# Altium schematic sheet RCD Snubber circuit.SchDoc
size B; Organization: Altium Limited; Address1: L3, 12a Rodborough Rd; Address2: Frenchs Forest; Address3: NSW; Address4: Australia 2086; SheetNumber: 1; SheetTotal: 1
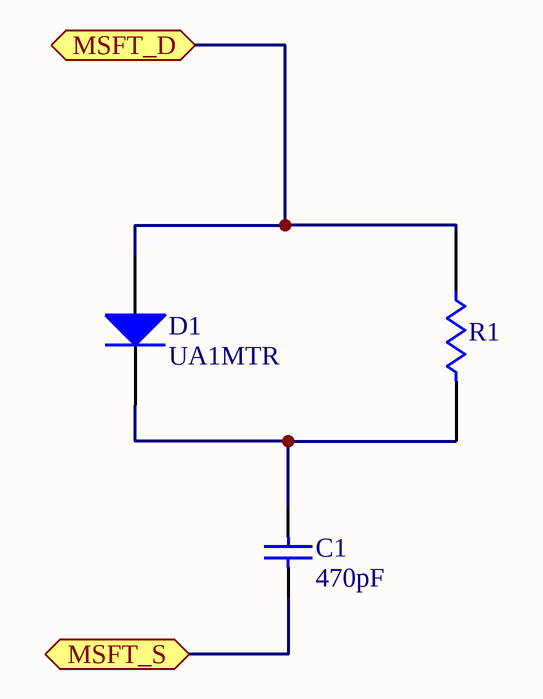
[diagram p0: RCD Snubber circuit.SchDoc]

## Parts
C1  Capacitance: 470pF  [CAP2220]  (hidden comment: C2220_Generic)
D1  UA1MTR  [DO-214AC]
R1  R2512_Generic  [RES2512]  (value not drawn)

## Ports
MSFT_D, MSFT_S

## Nets
MSFT_D: D1.2(A) R1.1 ; port MSFT_D
MSFT_S: C1.1 ; port MSFT_S
NetC1_2: C1.2 D1.1(K) R1.2

## Notes on the sheet
- Title:
- Size:
- B
- Document Number:
- Revision:
- Designer:
- Approval Date:
- Start Date:
- MM/DD/YY
- --/--/--
- Sheet:
- of
- Approver:
- CONFIDENTIAL
- Project Name/Number:

## Library data of the parts
D1 = UA1MTR: DIODE SCHOTTKY 1KV 1A SMA; Manufacturer: SMC Diode Solutions; Voltage - Forward (Vf) (Max) @ If: 1.7V @ 1A; Speed: Fast Recovery =< 500ns, > 200mA (Io); Current - Reverse Leakage @ Vr: 3µA @ 1000V; Supplier 1: Digi-Key; RoHS: RoHS Compliant; Category: Discrete Semiconductor Products; Stock 1: 48770; Pricing 1: 1=0.5, 10=0.358, 25=0.2784, 100=0.2109, 250=0.14924, 500=0.11938, 1000=0.09153, 2500=0.07959 (USD); Packaging: Cut Tape (CT); Part Status: Active; Diode Type: Schottky; Current - Average Rectified (Io): 1A; Capacitance @ Vr, F: -; Mounting Type: Surface Mount; Package / Case: DO-214AC, SMA; Supplier Device Package: SMA (DO-214AC); Operating Temperature - Junction: -55°C ~ 150°C; ComponentLink1URL: http://www.smc-diodes.com/propdf/UA1(A-M)%20N1509%20REV.-.pdf; ComponentLink1Description: http://www.smc-diodes.com/propdf/UA1(A-M)%20N1509%20REV.-.pdf; Supplier Part Number 1: 1655-1690-1-ND; Manufacturer Part Number: UA1MTR